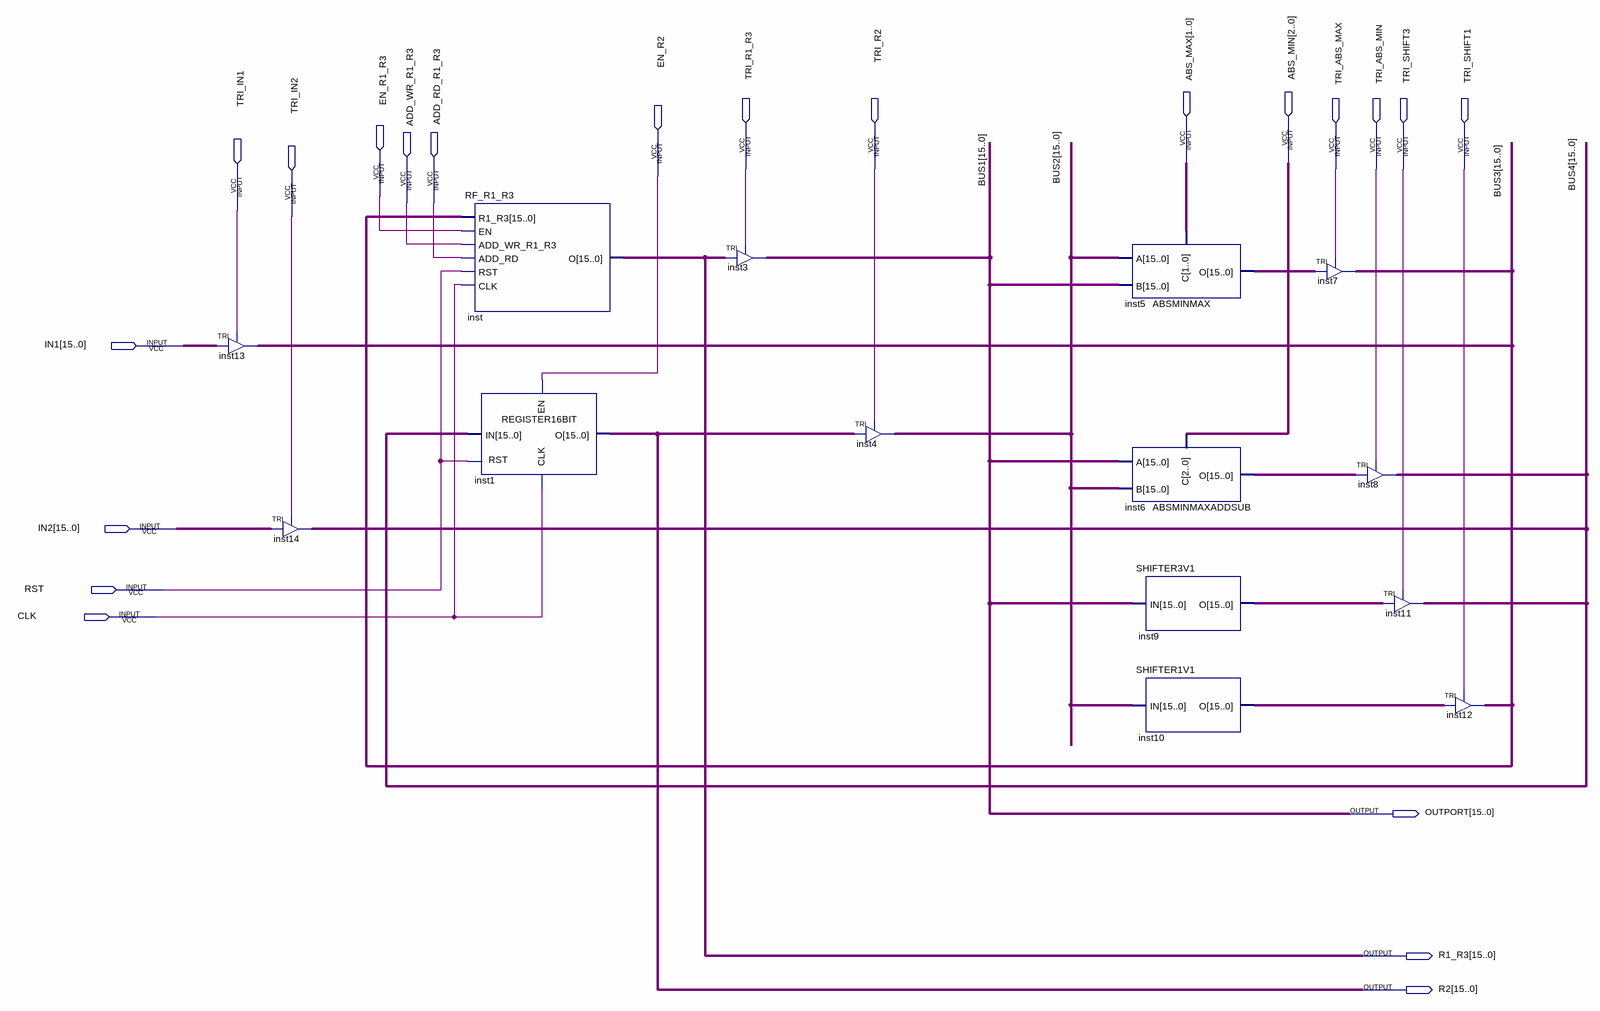
[diagram p0: schematic sheet]
// Quartus schematic DATAPATH_MR.bdf as structural Verilog: 14 symbols, 21 pins
module DATAPATH_MR (
  input  [1:0] ABS_MAX,
  input  [2:0] ABS_MIN,
  input  TRI_R1_R3,
  input  TRI_R2,
  input  TRI_ABS_MAX,
  input  TRI_ABS_MIN,
  input  TRI_SHIFT3,
  input  TRI_SHIFT1,
  input  EN_R2,
  input  EN_R1_R3,
  input  ADD_WR_R1_R3,
  input  ADD_RD_R1_R3,
  input  TRI_IN1,
  input  TRI_IN2,
  input  [15:0] IN1,
  input  [15:0] IN2,
  input  RST,
  input  CLK,
  output [15:0] OUTPORT,
  output [15:0] R1_R3,
  output [15:0] R2
);

  wire [15:0] BUS2, BUS3, BUS4, inst5_o, inst6_o, inst9_o, inst10_o;

  TRI inst13[15:0] (.IN(IN1), .OE(TRI_IN1), .OUT(BUS3));
  TRI inst14[15:0] (.IN(IN2), .OE(TRI_IN2), .OUT(BUS4));
  RF_R1_R3 inst (
    .R1_R3(BUS3), .EN(EN_R1_R3), .ADD_WR_R1_R3(ADD_WR_R1_R3), .ADD_RD(ADD_RD_R1_R3), .RST(RST), .CLK(CLK),
    .O(R1_R3));
  REGISTER16BIT inst1 (.IN(BUS4), .EN(EN_R2), .CLK(CLK), .RST(RST), .O(R2));
  TRI inst3[15:0] (.IN(R1_R3), .OE(TRI_R1_R3), .OUT(OUTPORT));
  TRI inst4[15:0] (.IN(R2), .OE(TRI_R2), .OUT(BUS2));
  ABSMINMAX inst5 (.C(ABS_MAX), .A(BUS2), .B(OUTPORT), .O(inst5_o));
  ABSMINMAXADDSUB inst6 (.C(ABS_MIN), .A(OUTPORT), .B(BUS2), .O(inst6_o));
  SHIFTER3V1 inst9 (.IN(OUTPORT), .O(inst9_o));
  SHIFTER1V1 inst10 (.IN(BUS2), .O(inst10_o));
  TRI inst7[15:0] (.IN(inst5_o), .OE(TRI_ABS_MAX), .OUT(BUS3));
  TRI inst8[15:0] (.IN(inst6_o), .OE(TRI_ABS_MIN), .OUT(BUS4));
  TRI inst11[15:0] (.IN(inst9_o), .OE(TRI_SHIFT3), .OUT(BUS4));
  TRI inst12[15:0] (.IN(inst10_o), .OE(TRI_SHIFT1), .OUT(BUS3));

  // Other names for the same wires on the sheet: BUS1[15:0] = OUTPORT
endmodule
